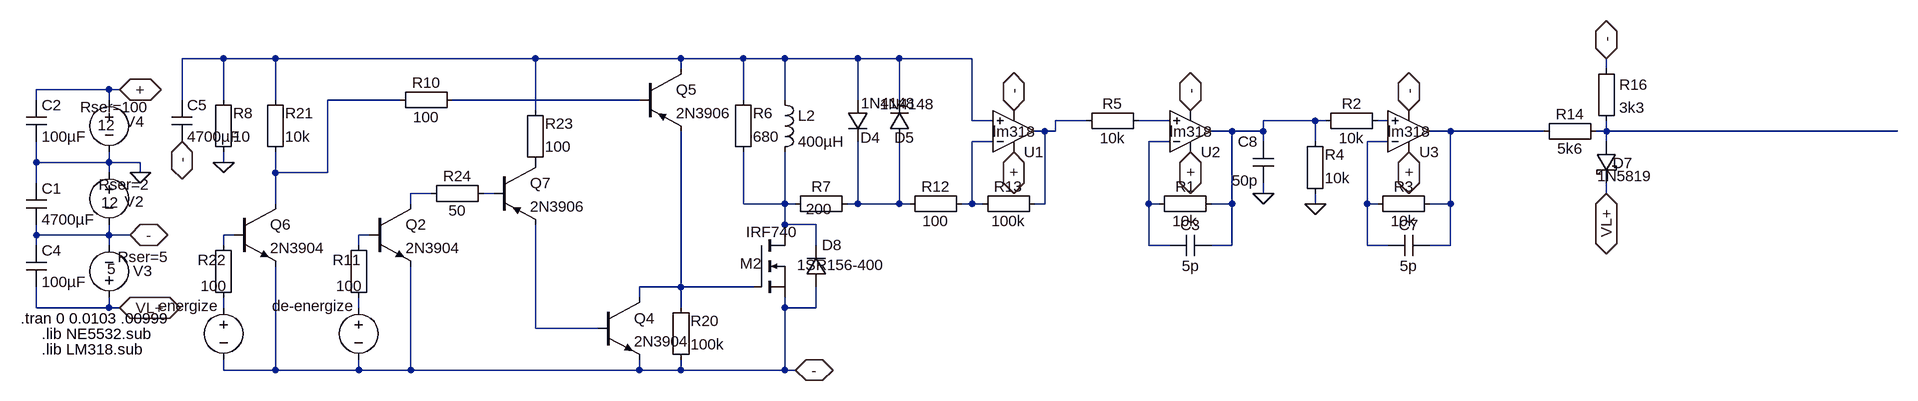
[diagram p0: schematic metal_low_power_fast_switch_4000.asc]
metal_low_power_fast_switch_4000.asc, the LTspice schematic file:
Version 4
SHEET 1 6068 1612
WIRE 96 -2400 32 -2400
WIRE 176 -2400 96 -2400
WIRE 576 -2400 176 -2400
WIRE 800 -2400 576 -2400
WIRE 896 -2400 800 -2400
WIRE 960 -2400 896 -2400
WIRE 1072 -2400 960 -2400
WIRE 1136 -2400 1072 -2400
WIRE 1248 -2400 1136 -2400
WIRE 800 -2384 800 -2400
WIRE 2224 -2384 2224 -2400
WIRE -80 -2352 -192 -2352
WIRE -64 -2352 -80 -2352
WIRE -192 -2336 -192 -2352
WIRE -80 -2336 -80 -2352
WIRE 32 -2336 32 -2400
WIRE 96 -2336 96 -2400
WIRE 176 -2336 176 -2400
WIRE 368 -2336 256 -2336
WIRE 736 -2336 448 -2336
WIRE 896 -2336 896 -2400
WIRE 960 -2336 960 -2400
WIRE 1072 -2336 1072 -2400
WIRE 1136 -2336 1136 -2400
WIRE 576 -2320 576 -2400
WIRE 1248 -2304 1248 -2400
WIRE 1280 -2304 1248 -2304
WIRE 1424 -2304 1376 -2304
WIRE 1552 -2304 1504 -2304
WIRE 1776 -2304 1696 -2304
WIRE 1792 -2304 1776 -2304
WIRE 1888 -2304 1872 -2304
WIRE 1360 -2288 1344 -2288
WIRE 1376 -2288 1376 -2304
WIRE 1376 -2288 1360 -2288
WIRE 1648 -2288 1616 -2288
WIRE 1696 -2288 1696 -2304
WIRE 1696 -2288 1648 -2288
WIRE 1984 -2288 1952 -2288
WIRE 2128 -2288 1984 -2288
WIRE 2224 -2288 2224 -2304
WIRE 2224 -2288 2208 -2288
WIRE 2672 -2288 2224 -2288
WIRE 1280 -2272 1248 -2272
WIRE 1552 -2272 1520 -2272
WIRE 1696 -2272 1696 -2288
WIRE 1776 -2272 1776 -2304
WIRE 1888 -2272 1856 -2272
WIRE 2224 -2272 2224 -2288
WIRE -192 -2240 -192 -2272
WIRE -80 -2240 -80 -2256
WIRE -80 -2240 -192 -2240
WIRE -32 -2240 -80 -2240
WIRE 96 -2240 96 -2256
WIRE -80 -2224 -80 -2240
WIRE -32 -2224 -32 -2240
WIRE 176 -2224 176 -2256
WIRE 256 -2224 256 -2336
WIRE 256 -2224 176 -2224
WIRE -192 -2208 -192 -2240
WIRE 416 -2192 384 -2192
WIRE 512 -2192 496 -2192
WIRE 1696 -2192 1696 -2208
WIRE 2224 -2192 2224 -2208
WIRE 176 -2176 176 -2224
WIRE 384 -2176 384 -2192
WIRE 896 -2176 896 -2256
WIRE 960 -2176 960 -2256
WIRE 960 -2176 896 -2176
WIRE 976 -2176 960 -2176
WIRE 1072 -2176 1072 -2272
WIRE 1072 -2176 1056 -2176
WIRE 1136 -2176 1136 -2272
WIRE 1136 -2176 1072 -2176
WIRE 1152 -2176 1136 -2176
WIRE 1248 -2176 1248 -2272
WIRE 1248 -2176 1232 -2176
WIRE 1264 -2176 1248 -2176
WIRE 1360 -2176 1360 -2288
WIRE 1360 -2176 1344 -2176
WIRE 1520 -2176 1520 -2272
WIRE 1536 -2176 1520 -2176
WIRE 1648 -2176 1648 -2288
WIRE 1648 -2176 1616 -2176
WIRE 1776 -2176 1776 -2192
WIRE 1856 -2176 1856 -2272
WIRE 1872 -2176 1856 -2176
WIRE 1984 -2176 1984 -2288
WIRE 1984 -2176 1952 -2176
WIRE 960 -2144 960 -2176
WIRE 1008 -2144 960 -2144
WIRE -192 -2128 -192 -2144
WIRE -80 -2128 -80 -2144
WIRE -80 -2128 -192 -2128
WIRE -48 -2128 -80 -2128
WIRE 112 -2128 96 -2128
WIRE 320 -2128 304 -2128
WIRE 960 -2128 960 -2144
WIRE -192 -2112 -192 -2128
WIRE -80 -2112 -80 -2128
WIRE 96 -2112 96 -2128
WIRE 304 -2112 304 -2128
WIRE 1008 -2112 1008 -2144
WIRE 1520 -2112 1520 -2176
WIRE 1552 -2112 1520 -2112
WIRE 1648 -2112 1648 -2176
WIRE 1648 -2112 1616 -2112
WIRE 1856 -2112 1856 -2176
WIRE 1888 -2112 1856 -2112
WIRE 1984 -2112 1984 -2176
WIRE 1984 -2112 1952 -2112
WIRE 800 -2048 800 -2288
WIRE 800 -2048 736 -2048
WIRE 912 -2048 800 -2048
WIRE 736 -2032 736 -2048
WIRE -192 -2016 -192 -2048
WIRE -80 -2016 -80 -2032
WIRE -80 -2016 -192 -2016
WIRE -64 -2016 -80 -2016
WIRE 96 -2016 96 -2032
WIRE 304 -2016 304 -2032
WIRE 800 -2016 800 -2048
WIRE 960 -2016 960 -2032
WIRE 1008 -2016 1008 -2048
WIRE 1008 -2016 960 -2016
WIRE 576 -1984 576 -2144
WIRE 672 -1984 576 -1984
WIRE 96 -1920 96 -1936
WIRE 176 -1920 176 -2080
WIRE 176 -1920 96 -1920
WIRE 304 -1920 304 -1936
WIRE 304 -1920 176 -1920
WIRE 384 -1920 384 -2080
WIRE 384 -1920 304 -1920
WIRE 736 -1920 736 -1936
WIRE 736 -1920 384 -1920
WIRE 800 -1920 800 -1936
WIRE 800 -1920 736 -1920
WIRE 960 -1920 960 -2016
WIRE 960 -1920 800 -1920
WIRE 976 -1920 960 -1920
FLAG -48 -2128 -
IOPIN -48 -2128 BiDir
FLAG -64 -2352 +
IOPIN -64 -2352 BiDir
FLAG -32 -2224 0
FLAG -64 -2016 VL+
IOPIN -64 -2016 BiDir
FLAG 32 -2272 -
IOPIN 32 -2272 BiDir
FLAG 96 -2240 0
FLAG 1312 -2256 +
IOPIN 1312 -2256 BiDir
FLAG 1312 -2320 -
IOPIN 1312 -2320 BiDir
FLAG 2224 -2400 -
IOPIN 2224 -2400 BiDir
FLAG 2224 -2192 VL+
IOPIN 2224 -2192 BiDir
FLAG 976 -1920 -
IOPIN 976 -1920 BiDir
FLAG 1584 -2256 +
IOPIN 1584 -2256 BiDir
FLAG 1584 -2320 -
IOPIN 1584 -2320 BiDir
FLAG 1920 -2256 +
IOPIN 1920 -2256 BiDir
FLAG 1920 -2320 -
IOPIN 1920 -2320 BiDir
FLAG 1696 -2192 0
FLAG 1776 -2176 0
SYMBOL voltage -80 -2240 M0
WINDOW 123 0 0 Left 2
WINDOW 39 -63 34 Left 2
WINDOW 0 -53 60 Left 2
WINDOW 3 -15 62 Left 2
SYMATTR SpiceLine Rser=2
SYMATTR InstName V2
SYMATTR Value 12
SYMBOL voltage -80 -2352 M0
WINDOW 123 0 0 Left 2
WINDOW 39 -61 27 Left 2
WINDOW 0 -54 49 Left 2
WINDOW 3 -9 55 Left 2
SYMATTR SpiceLine Rser=100
SYMATTR InstName V4
SYMATTR Value 12
SYMBOL voltage -80 -2016 M180
WINDOW 123 0 0 Left 2
WINDOW 39 13 78 Left 2
WINDOW 0 37 57 Left 2
WINDOW 3 -3 60 Left 2
SYMATTR SpiceLine Rser=5
SYMATTR InstName V3
SYMATTR Value 5
SYMBOL Misc\\EuropeanCap -208 -2208 R0
SYMATTR InstName C1
SYMATTR Value 4700µF
SYMATTR SpiceLine V=400 Irms=1 Rser=.32 Lser=0
SYMBOL Misc\\EuropeanCap -208 -2336 R0
SYMATTR InstName C2
SYMATTR Value 100µF
SYMATTR SpiceLine V=400 Irms=1 Rser=.32 Lser=0
SYMBOL Misc\\EuropeanCap -208 -2112 R0
SYMATTR InstName C4
SYMATTR Value 100µF
SYMATTR SpiceLine V=400 Irms=1 Rser=.32 Lser=0
SYMBOL Misc\\EuropeanCap 16 -2336 R0
SYMATTR InstName C5
SYMATTR Value 4700µF
SYMATTR SpiceLine V=400 Irms=1 Rser=.32 Lser=0
SYMBOL ind 944 -2352 R0
SYMATTR InstName L2
SYMATTR Value 400µH
SYMATTR SpiceLine Rser=.5 Cpar=200p
SYMBOL Misc\\EuropeanResistor 880 -2240 M180
WINDOW 0 31 76 Left 2
WINDOW 3 31 40 Left 2
SYMATTR InstName R6
SYMATTR Value 680
SYMBOL Misc\\EuropeanResistor 960 -2192 M90
WINDOW 0 5 56 VBottom 2
WINDOW 3 8 53 VTop 2
SYMATTR InstName R7
SYMATTR Value 200
SYMBOL diode 1056 -2336 R0
WINDOW 3 21 5 Left 2
WINDOW 0 20 58 Left 2
SYMATTR Value 1N4148
SYMATTR InstName D4
SYMBOL diode 1152 -2272 R180
WINDOW 0 -7 6 Left 2
WINDOW 3 -39 58 Left 2
SYMATTR InstName D5
SYMATTR Value 1N4148
SYMBOL Misc\\EuropeanResistor 80 -2240 M180
WINDOW 0 31 76 Left 2
WINDOW 3 31 40 Left 2
SYMATTR InstName R8
SYMATTR Value 10
SYMBOL nmos 912 -2128 R0
WINDOW 0 -21 44 Left 2
WINDOW 3 -12 -5 Left 2
SYMATTR InstName M2
SYMATTR Value IRF740
SYMBOL voltage 304 -2032 M0
WINDOW 0 5 13 Left 2
WINDOW 3 -134 119 Invisible 2
WINDOW 123 0 0 Left 2
SYMATTR InstName de-energize
SYMATTR Value PULSE(0 4.8 .01015 0 0 .00001 .01 1000)
SYMATTR SpiceLine Rser=0
SYMBOL npn3 320 -2176 R0
SYMATTR InstName Q2
SYMATTR Value 2N3904
SYMBOL Misc\\EuropeanResistor 288 -2016 M180
WINDOW 0 -24 74 Left 2
WINDOW 3 -19 34 Left 2
SYMATTR InstName R11
SYMATTR Value 100
SYMBOL Opamps\\opamp2 1312 -2224 M180
WINDOW 3 -32 63 Left 2
SYMATTR Value lm318
SYMATTR InstName U1
SYMBOL Misc\\EuropeanResistor 1136 -2160 R270
WINDOW 0 27 56 VTop 2
WINDOW 3 5 56 VBottom 2
SYMATTR InstName R12
SYMATTR Value 100
SYMBOL Misc\\EuropeanResistor 1248 -2160 R270
WINDOW 0 27 56 VTop 2
WINDOW 3 5 56 VBottom 2
SYMATTR InstName R13
SYMATTR Value 100k
SYMBOL Misc\\EuropeanResistor 2112 -2304 M90
WINDOW 0 5 56 VBottom 2
WINDOW 3 27 56 VTop 2
SYMATTR InstName R14
SYMATTR Value 5k6
SYMBOL Misc\\EuropeanResistor 2208 -2400 R0
SYMATTR InstName R16
SYMATTR Value 3k3
SYMBOL schottky 2240 -2272 M0
WINDOW 0 -25 33 Left 2
WINDOW 3 -55 53 Left 2
SYMATTR InstName D7
SYMATTR Value 1N5819
SYMATTR Description Diode
SYMATTR Type diode
SYMBOL npn3 672 -2032 R0
SYMATTR InstName Q4
SYMATTR Value 2N3904
SYMBOL diode 1024 -2048 R180
WINDOW 0 -24 65 Left 2
WINDOW 3 -90 34 Left 2
SYMATTR InstName D8
SYMATTR Value 1SR156-400
SYMATTR Description Zener Diode
SYMATTR Type zener
SYMBOL pnp2 736 -2384 R0
SYMATTR InstName Q5
SYMATTR Value 2N3906
SYMBOL Misc\\EuropeanResistor 784 -1920 M180
WINDOW 0 31 76 Left 2
WINDOW 3 31 40 Left 2
SYMATTR InstName R20
SYMATTR Value 100k
SYMBOL voltage 96 -2032 M0
WINDOW 0 7 13 Left 2
WINDOW 3 -134 119 Invisible 2
WINDOW 123 0 0 Left 2
SYMATTR InstName energize
SYMATTR Value PULSE(0 4.8 .01 0 0 .00012 .01 1000)
SYMATTR SpiceLine Rser=0
SYMBOL npn3 112 -2176 R0
SYMATTR InstName Q6
SYMATTR Value 2N3904
SYMBOL Misc\\EuropeanResistor 160 -2240 M180
WINDOW 0 31 76 Left 2
WINDOW 3 31 40 Left 2
SYMATTR InstName R21
SYMATTR Value 10k
SYMBOL Misc\\EuropeanResistor 80 -2016 M180
WINDOW 0 -24 74 Left 2
WINDOW 3 -19 34 Left 2
SYMATTR InstName R22
SYMATTR Value 100
SYMBOL Misc\\EuropeanResistor 352 -2352 M90
WINDOW 0 5 56 VBottom 2
WINDOW 3 27 56 VTop 2
SYMATTR InstName R10
SYMATTR Value 100
SYMBOL pnp2 512 -2240 R0
SYMATTR InstName Q7
SYMATTR Value 2N3906
SYMBOL Misc\\EuropeanResistor 560 -2224 M180
WINDOW 0 31 76 Left 2
WINDOW 3 31 40 Left 2
SYMATTR InstName R23
SYMATTR Value 100
SYMBOL Misc\\EuropeanResistor 400 -2208 M90
WINDOW 0 5 56 VBottom 2
WINDOW 3 27 56 VTop 2
SYMATTR InstName R24
SYMATTR Value 50
SYMBOL Opamps\\opamp2 1584 -2224 M180
WINDOW 3 -32 63 Left 2
SYMATTR Value lm318
SYMATTR InstName U2
SYMBOL Misc\\EuropeanResistor 1520 -2160 R270
WINDOW 0 27 56 VTop 2
WINDOW 3 5 56 VBottom 2
SYMATTR InstName R1
SYMATTR Value 10k
SYMBOL Misc\\EuropeanCap 1616 -2128 R90
WINDOW 0 0 32 VBottom 2
WINDOW 3 32 32 VTop 2
SYMATTR InstName C3
SYMATTR Value 5p
SYMATTR SpiceLine V=400 Irms=1 Rser=.32 Lser=0
SYMBOL Opamps\\opamp2 1920 -2224 M180
WINDOW 3 -32 63 Left 2
SYMATTR Value lm318
SYMATTR InstName U3
SYMBOL Misc\\EuropeanResistor 1856 -2160 R270
WINDOW 0 27 56 VTop 2
WINDOW 3 5 56 VBottom 2
SYMATTR InstName R3
SYMATTR Value 10k
SYMBOL Misc\\EuropeanCap 1952 -2128 R90
WINDOW 0 0 32 VBottom 2
WINDOW 3 32 32 VTop 2
SYMATTR InstName C7
SYMATTR Value 5p
SYMATTR SpiceLine V=400 Irms=1 Rser=.32 Lser=0
SYMBOL Misc\\EuropeanCap 1712 -2208 R180
WINDOW 0 24 64 Left 2
WINDOW 3 24 4 Left 2
SYMATTR InstName C8
SYMATTR Value 50p
SYMATTR SpiceLine V=400 Irms=1 Rser=.32 Lser=0
SYMBOL Misc\\EuropeanResistor 1760 -2176 M180
WINDOW 0 31 76 Left 2
WINDOW 3 31 40 Left 2
SYMATTR InstName R4
SYMATTR Value 10k
SYMBOL Misc\\EuropeanResistor 1776 -2288 R270
WINDOW 0 27 56 VTop 2
WINDOW 3 5 56 VBottom 2
SYMATTR InstName R2
SYMATTR Value 10k
SYMBOL Misc\\EuropeanResistor 1408 -2288 R270
WINDOW 0 27 56 VTop 2
WINDOW 3 5 56 VBottom 2
SYMATTR InstName R5
SYMATTR Value 10k
TEXT -216 -2000 Left 2 !.tran 0 0.0103 .00999
TEXT -184 -1976 Left 2 !.lib NE5532.sub
TEXT -184 -1952 Left 2 !.lib LM318.sub

The netlist it stands for:
* metal_low_power_fast_switch_4000.asc
V2 0 - 12 Rser=2
V4 + 0 12 Rser=100
V3 VL+ - 5 Rser=5
C1 0 - 4700µF V=400 Irms=1 Rser=.32 Lser=0
C2 + 0 100µF V=400 Irms=1 Rser=.32 Lser=0
C4 - VL+ 100µF V=400 Irms=1 Rser=.32 Lser=0
C5 N001 - 4700µF V=400 Irms=1 Rser=.32 Lser=0
L2 N001 N015 400µH Rser=.5 Cpar=200p
R6 N015 N001 680
R7 N015 N016 200
D4 N001 N016 1N4148
D5 N016 N001 1N4148
R8 0 N001 10
M2 N015 N019 - - IRF740
V§de-energize N021 - PULSE(0 4.8 .01015 0 0 .00001 .01 1000) Rser=0
Q2 N013 N018 - 0 2N3904
R11 N021 N018 100
XU1 N001 N010 + - N004 lm318  ; pins In+ In- V+ V- OUT
R12 N016 N010 100
R13 N010 N004 100k
R14 N008 N009 5k6
R16 - N009 3k3
D7 N009 VL+ 1N5819
Q4 N019 N022 - 0 2N3904
D8 - N015 1SR156-400
Q5 N001 N003 N019 0 2N3906
R20 - N019 100k
V§energize N020 - PULSE(0 4.8 .01 0 0 .00012 .01 1000) Rser=0
Q6 N002 N017 - 0 2N3904
R21 N002 N001 10k
R22 N020 N017 100
R10 N002 N003 100
Q7 P001 N014 N022 0 2N3906
R23 P001 N001 100
R24 N013 N014 50
XU2 N005 N011 + - N006 lm318  ; pins In+ In- V+ V- OUT
R1 N011 N006 10k
C3 N006 N011 5p V=400 Irms=1 Rser=.32 Lser=0
XU3 N007 N012 + - N008 lm318  ; pins In+ In- V+ V- OUT
R3 N012 N008 10k
C7 N008 N012 5p V=400 Irms=1 Rser=.32 Lser=0
C8 0 N006 50p V=400 Irms=1 Rser=.32 Lser=0
R4 0 N006 10k
R2 N006 N007 10k
R5 N004 N005 10k
.model D D
.lib standard.dio
.model NPN NPN
.model PNP PNP
.lib standard.bjt
.model NMOS NMOS
.model PMOS PMOS
.lib standard.mos
.tran 0 0.0103 .00999
.lib NE5532.sub
.lib LM318.sub
.backanno
.end